# EAGLE schematic Aegis PCB 3D - 2 v37 (EAGLE 9.7.0)

## Sheet 1 of 4: Board Conn
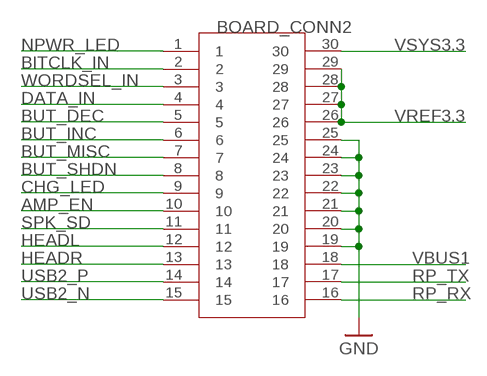
[diagram p0: schematic, sheet 1]

### Parts
BOARD_CONN2  CONN-AXK6F30347YG  [CONN-AXK6F30347YG]

### Nets
AMP_EN: BOARD_CONN2.10 ; also sheet 3
BITCLK_IN: BOARD_CONN2.2 ; also sheet 3
BUT_DEC: BOARD_CONN2.5 ; also sheet 4
BUT_INC: BOARD_CONN2.6 ; also sheet 4
BUT_MISC: BOARD_CONN2.7 ; also sheet 4
BUT_SHDN: BOARD_CONN2.8 ; also sheet 4
CHG_LED: BOARD_CONN2.9 ; also sheet 4
DATA_IN: BOARD_CONN2.4 ; also sheet 3
GND: BOARD_CONN2.19 BOARD_CONN2.20 BOARD_CONN2.21 BOARD_CONN2.22 BOARD_CONN2.23 BOARD_CONN2.24 BOARD_CONN2.25 ; also sheet 2,3,4
HEADL: BOARD_CONN2.12 ; also sheet 3
HEADR: BOARD_CONN2.13 ; also sheet 3
NPWR_LED: BOARD_CONN2.1 ; also sheet 2
RP_RX: BOARD_CONN2.16 ; also sheet 2
RP_TX: BOARD_CONN2.17 ; also sheet 2
SPK_SD: BOARD_CONN2.11 ; also sheet 3
USB2_N: BOARD_CONN2.15 ; also sheet 2
USB2_P: BOARD_CONN2.14 ; also sheet 2
VBUS1: BOARD_CONN2.18 ; also sheet 2
VREF3.3: BOARD_CONN2.26 BOARD_CONN2.27 BOARD_CONN2.28 BOARD_CONN2.29 ; also sheet 2,3
VSYS3.3: BOARD_CONN2.30 ; also sheet 4
WORDSEL_IN: BOARD_CONN2.3 ; also sheet 3

## Sheet 2 of 4: Controller
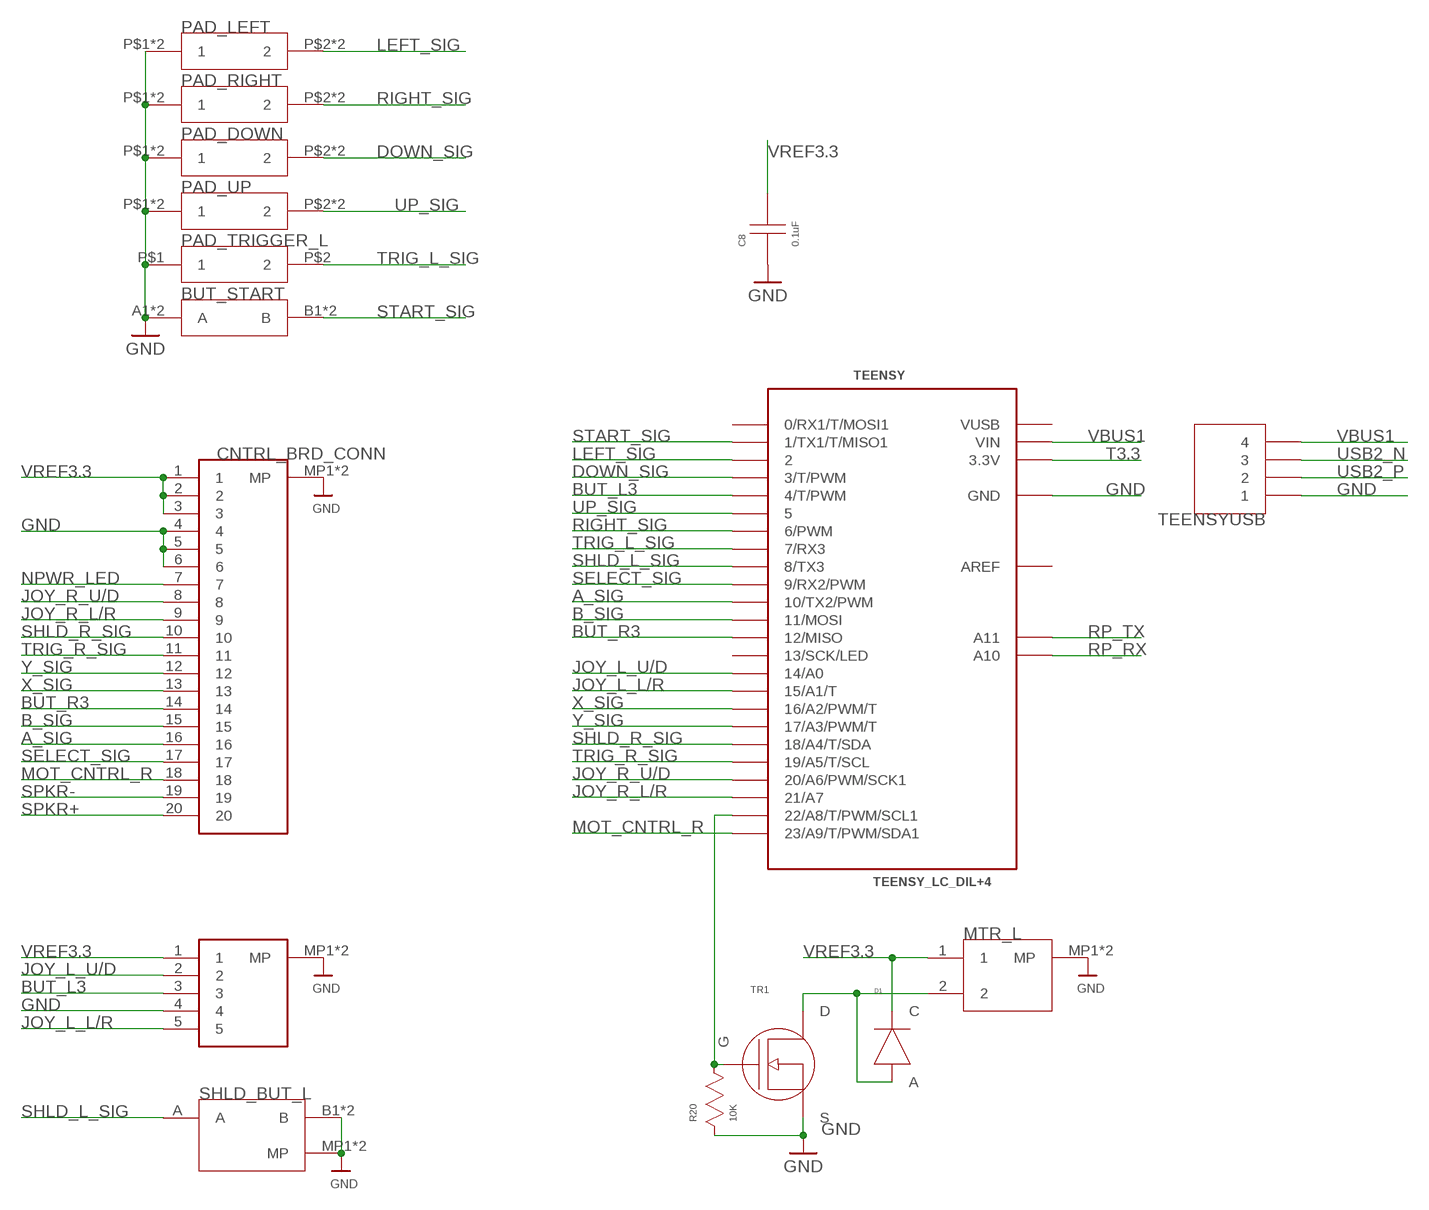
[diagram p1: schematic, sheet 2]

### Parts
BUT_START  BUT-R-667834  [BUT-R-667834]
C8  0.1uF  CAP-603  [CAP-603]
CNTRL_BRD_CONN  CONN-0527462033  [CONN-0527462033]
D1  DIODE-X3-WLB1608-2  [DIODE-X3-WLB1608-2]
JOYSTICK_L  CONN-046809605110846+  [CONN-046809605110846+]
MTR_L  CONN-0781710002  [CONN-0781710002]
PAD_DOWN  AEGIS-BUTTONPAD  [AEGIS-BUTTONPAD]
PAD_LEFT  AEGIS-BUTTONPAD  [AEGIS-BUTTONPAD]
PAD_RIGHT  AEGIS-BUTTONPAD  [AEGIS-BUTTONPAD]
PAD_TRIGGER_L  AEGIN-SHLDPAD  [AEGIN-SHLDPAD]
PAD_UP  AEGIS-BUTTONPAD  [AEGIS-BUTTONPAD]
R20  10K  RES-603  [RES-603]
SHLD_BUT_L  AEGIN-SHLDBUT  [AEGIN-SHLDBUT]
TEENSY  TEENSY_LC_DIL+4  [TEENSY_3.0-3.2&LC_DIL+4]
TEENSYUSB  CONN_4PIN  [CONN_4PIN]
TR1  TRAN-DMG2302UKQ  [TRAN-DMG2302UKQ]

### Nets
A_SIG: CNTRL_BRD_CONN.16 TEENSY.10(10/TX2/PWM)
B_SIG: CNTRL_BRD_CONN.15 TEENSY.11(11/MOSI)
BUT_L3: JOYSTICK_L.3 TEENSY.4(4/T/PWM)
BUT_R3: CNTRL_BRD_CONN.14 TEENSY.12(12/MISO)
DOWN_SIG: PAD_DOWN.P$2 PAD_DOWN.P$4 TEENSY.3(3/T/PWM)
GND: BUT_START.A1(A) BUT_START.A2(A) C8.A CNTRL_BRD_CONN.4 CNTRL_BRD_CONN.5 CNTRL_BRD_CONN.6 CNTRL_BRD_CONN.MP1(MP) CNTRL_BRD_CONN.MP2(MP) JOYSTICK_L.4 JOYSTICK_L.MP1(MP) JOYSTICK_L.MP2(MP) MTR_L.MP1(MP) MTR_L.MP2(MP) PAD_DOWN.P$1 PAD_DOWN.P$3 PAD_LEFT.P$1 PAD_LEFT.P$3 PAD_RIGHT.P$1 PAD_RIGHT.P$3 PAD_TRIGGER_L.P$1 PAD_UP.P$1 PAD_UP.P$3 R20.A SHLD_BUT_L.B1(B) SHLD_BUT_L.B2(B) SHLD_BUT_L.MP1(MP) SHLD_BUT_L.MP2(MP) TEENSY.AGND(GND) TEENSY.GND TEENSYUSB.1 TR1.S ; also sheet 1,3,4
JOY_L_L/R: JOYSTICK_L.5 TEENSY.15/A1(15/A1/T)
JOY_L_U/D: JOYSTICK_L.2 TEENSY.14/A0
JOY_R_L/R: CNTRL_BRD_CONN.9 TEENSY.21/A7
JOY_R_U/D: CNTRL_BRD_CONN.8 TEENSY.20/A6(20/A6/PWM/SCK1)
LEFT_SIG: PAD_LEFT.P$2 PAD_LEFT.P$4 TEENSY.2
MOT_CNTRL_R: CNTRL_BRD_CONN.18 TEENSY.23/A9(23/A9/T/PWM/SDA1)
N$1: R20.C TEENSY.22/A8(22/A8/T/PWM/SCL1) TR1.G
N$8: D1.A MTR_L.2 TR1.D
NPWR_LED: CNTRL_BRD_CONN.7 ; also sheet 1
RIGHT_SIG: PAD_RIGHT.P$2 PAD_RIGHT.P$4 TEENSY.6(6/PWM)
RP_RX: TEENSY.A10 ; also sheet 1
RP_TX: TEENSY.A11 ; also sheet 1
SELECT_SIG: CNTRL_BRD_CONN.17 TEENSY.9(9/RX2/PWM)
SHLD_L_SIG: SHLD_BUT_L.A TEENSY.8(8/TX3)
SHLD_R_SIG: CNTRL_BRD_CONN.10 TEENSY.18/A4(18/A4/T/SDA)
SPKR+: CNTRL_BRD_CONN.20 ; also sheet 3
SPKR-: CNTRL_BRD_CONN.19 ; also sheet 3
START_SIG: BUT_START.B1(B) BUT_START.B2(B) TEENSY.1(1/TX1/T/MISO1)
T3.3: TEENSY.3.3V
TRIG_L_SIG: PAD_TRIGGER_L.P$2 TEENSY.7(7/RX3)
TRIG_R_SIG: CNTRL_BRD_CONN.11 TEENSY.19/A5(19/A5/T/SCL)
UP_SIG: PAD_UP.P$2 PAD_UP.P$4 TEENSY.5
USB2_N: TEENSYUSB.3 ; also sheet 1
USB2_P: TEENSYUSB.2 ; also sheet 1
VBUS1: TEENSY.VIN TEENSYUSB.4 ; also sheet 1
VREF3.3: C8.C CNTRL_BRD_CONN.1 CNTRL_BRD_CONN.2 CNTRL_BRD_CONN.3 D1.C JOYSTICK_L.1 MTR_L.1 ; also sheet 1,3
X_SIG: CNTRL_BRD_CONN.13 TEENSY.16/A2(16/A2/PWM/T)
Y_SIG: CNTRL_BRD_CONN.12 TEENSY.17/A3(17/A3/PWM/T)
Unconnected: TEENSY.0(0/RX1/T/MOSI1) TEENSY.13(13/SCK/LED)

## Sheet 3 of 4: Audio
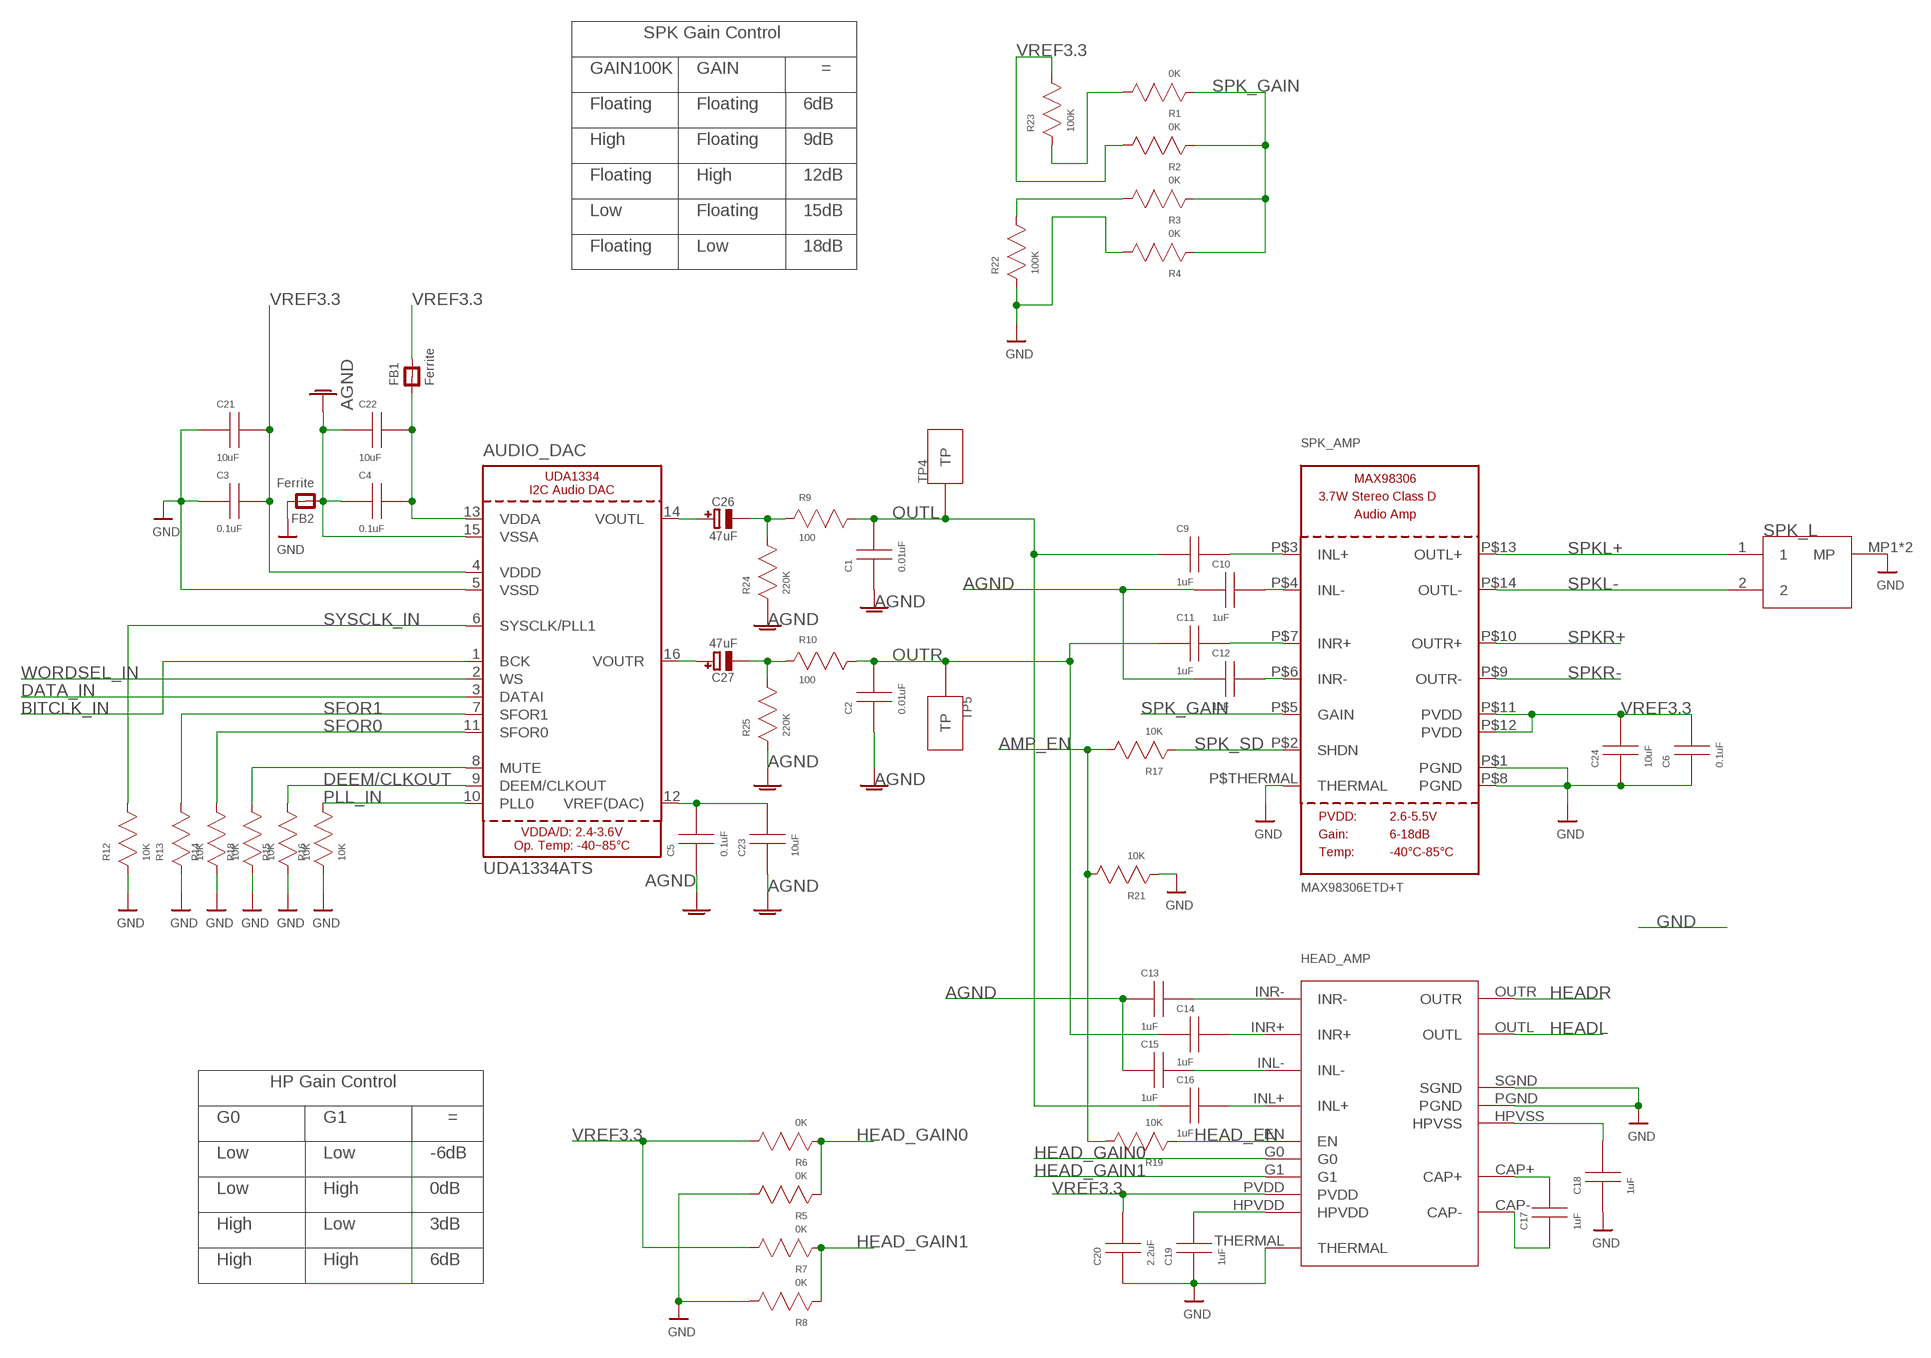
[diagram p2: schematic, sheet 3]

### Parts
AUDIO_DAC  UDA1334ATS  AUDIO_I2S_UDA1334""  [SSOP16_4.4MM]
C1  0.01uF  CAP-603  [CAP-603]
C2  0.01uF  CAP-603  [CAP-603]
C3  0.1uF  CAP-603  [CAP-603]
C4  0.1uF  CAP-603  [CAP-603]
C5  0.1uF  CAP-603  [CAP-603]
C6  0.1uF  CAP-603  [CAP-603]
C9  1uF  CAP-603  [CAP-603]
C10  1uF  CAP-603  [CAP-603]
C11  1uF  CAP-603  [CAP-603]
C12  1uF  CAP-603  [CAP-603]
C13  1uF  CAP-603  [CAP-603]
C14  1uF  CAP-603  [CAP-603]
C15  1uF  CAP-603  [CAP-603]
C16  1uF  CAP-603  [CAP-603]
C17  1uF  CAP-603  [CAP-603]
C18  1uF  CAP-603  [CAP-603]
C19  1uF  CAP-603  [CAP-603]
C20  2.2uF  CAP-603  [CAP-603]
C21  10uF  CAP-603  [CAP-603]
C22  10uF  CAP-603  [CAP-603]
C23  10uF  CAP-603  [CAP-603]
C24  10uF  CAP-603  [CAP-603]
C26  47uF  CAP_ELECTROLYTICPANASONIC_C  [PANASONIC_C]
C27  47uF  CAP_ELECTROLYTICPANASONIC_C  [PANASONIC_C]
FB1  Ferrite  FERRITE0805  [0805@1]
FB2  Ferrite  FERRITE0805  [0805@1]
HEAD_AMP  IC-PAM8908  [IC-PAM8908]
R1  0K  RES-603  [RES-603]
R2  0K  RES-603  [RES-603]
R3  0K  RES-603  [RES-603]
R4  0K  RES-603  [RES-603]
R5  0K  RES-603  [RES-603]
R6  0K  RES-603  [RES-603]
R7  0K  RES-603  [RES-603]
R8  0K  RES-603  [RES-603]
R9  100  RES-603  [RES-603]
R10  100  RES-603  [RES-603]
R12  10K  RES-603  [RES-603]
R13  10K  RES-603  [RES-603]
R14  10K  RES-603  [RES-603]
R15  10K  RES-603  [RES-603]
R16  10K  RES-603  [RES-603]
R17  10K  RES-603  [RES-603]
R18  10K  RES-603  [RES-603]
R19  10K  RES-603  [RES-603]
R21  10K  RES-603  [RES-603]
R22  100K  RES-603  [RES-603]
R23  100K  RES-603  [RES-603]
R24  220K  RES-603  [RES-603]
R25  220K  RES-603  [RES-603]
SPK_AMP  MAX98306ETD+T  AUDIOAMP_MAX98306  [TDFN14_3X3MM]
SPK_L  CONN-0781710002  [CONN-0781710002]
TP4  TESTPOINT  [TESTPOINT]
TP5  TESTPOINT  [TESTPOINT]

### Nets
AGND: AUDIO_DAC.15(VSSA) C1.A C2.A C4.A C5.A C10.A C12.A C13.A C15.A C22.A C23.A FB2.1 R24.A R25.A
AMP_EN: R17.C R19.C R21.C ; also sheet 1
BITCLK_IN: AUDIO_DAC.1(BCK) ; also sheet 1
DATA_IN: AUDIO_DAC.3(DATAI) ; also sheet 1
DEEM/CLKOUT: AUDIO_DAC.9(DEEM/CLKOUT) R15.C
GND: AUDIO_DAC.5(VSSD) C3.A C6.A C18.A C19.A C20.A C21.A C24.A FB2.2 HEAD_AMP.PGND HEAD_AMP.SGND HEAD_AMP.THERMAL R4.C R5.C R8.C R12.A R13.A R14.A R15.A R16.A R18.A R21.A R22.A SPK_AMP.P$1(PGND) SPK_AMP.P$8(PGND) SPK_AMP.P$THERMAL(THERMAL) SPK_L.MP1(MP) SPK_L.MP2(MP) ; also sheet 1,2,4
HEAD_EN: HEAD_AMP.EN R19.A
HEAD_GAIN0: HEAD_AMP.G0 R5.A R6.A
HEAD_GAIN1: HEAD_AMP.G1 R7.A R8.A
HEADL: HEAD_AMP.OUTL ; also sheet 1
HEADR: HEAD_AMP.OUTR ; also sheet 1
N$2: AUDIO_DAC.8(MUTE) R18.C
N$3: AUDIO_DAC.13(VDDA) C4.C C22.C FB1.1
N$5: C27.- R10.A R25.C
N$7: C26.- R9.A R24.C
N$9: C13.C HEAD_AMP.INR-
N$10: AUDIO_DAC.12(VREF(DAC)) C5.C C23.C
N$12: AUDIO_DAC.16(VOUTR) C27.+
N$13: AUDIO_DAC.14(VOUTL) C26.+
N$14: R1.C R23.A
N$15: R3.C R22.C
N$16: C9.C SPK_AMP.P$3(INL+)
N$17: C10.C SPK_AMP.P$4(INL-)
N$18: C11.C SPK_AMP.P$7(INR+)
N$19: C12.C SPK_AMP.P$6(INR-)
N$21: C14.C HEAD_AMP.INR+
N$22: C16.C HEAD_AMP.INL+
N$23: C15.C HEAD_AMP.INL-
N$24: C17.C HEAD_AMP.CAP+
N$28: C17.A HEAD_AMP.CAP-
N$29: C18.C HEAD_AMP.HPVSS
N$30: C19.C HEAD_AMP.HPVDD
OUTL: C1.C C9.A C16.A R9.C TP4.TP
OUTR: C2.C C11.A C14.A R10.C TP5.TP
PLL_IN: AUDIO_DAC.10(PLL0) R16.C
SFOR0: AUDIO_DAC.11(SFOR0) R14.C
SFOR1: AUDIO_DAC.7(SFOR1) R13.C
SPK_GAIN: R1.A R2.A R3.A R4.A SPK_AMP.P$5(GAIN)
SPK_SD: R17.A SPK_AMP.P$2(SHDN) ; also sheet 1
SPKL+: SPK_AMP.P$13(OUTL+) SPK_L.1
SPKL-: SPK_AMP.P$14(OUTL-) SPK_L.2
SPKR+: SPK_AMP.P$10(OUTR+) ; also sheet 2
SPKR-: SPK_AMP.P$9(OUTR-) ; also sheet 2
SYSCLK_IN: AUDIO_DAC.6(SYSCLK/PLL1) R12.C
VREF3.3: AUDIO_DAC.4(VDDD) C3.C C6.C C20.C C21.C C24.C FB1.2 HEAD_AMP.PVDD R2.C R6.C R7.C R23.C SPK_AMP.P$11(PVDD) SPK_AMP.P$12(PVDD) ; also sheet 1,2
WORDSEL_IN: AUDIO_DAC.2(WS) ; also sheet 1

### Notes on the sheet
- SPK Gain Control
- GAIN100K | GAIN | =
- Floating | Floating | 6dB
- High | Floating | 9dB
- Floating | High | 12dB
- Low | Floating | 15dB
- Floating | Low | 18dB
- HP Gain Control
- G0 | G1 | =
- Low | Low | -6dB
- Low | High | 0dB
- High | Low | 3dB
- High | High | 6dB

## Sheet 4 of 4: Button/LED
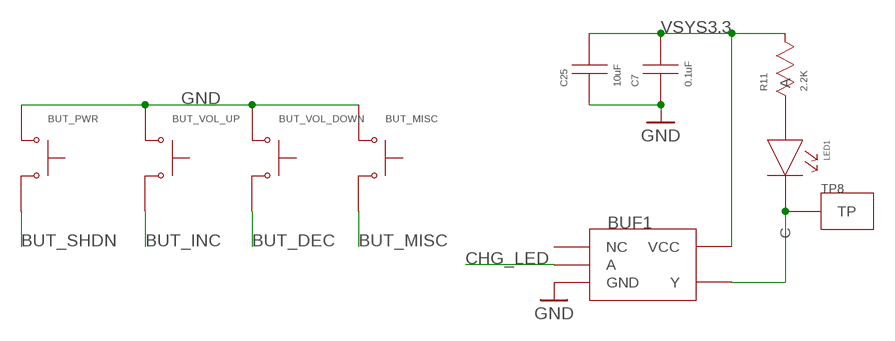
[diagram p3: schematic, sheet 4]

### Parts
BUF1  BUF-74LVC1G07  [BUF-74LVC1G07]
BUT_MISC  BUT-KSS331GLFS  [BUT-KSS331GLFS]
BUT_PWR  BUT-KSS331GLFS  [BUT-KSS331GLFS]
BUT_VOL_DOWN  BUT-KSS331GLFS  [BUT-KSS331GLFS]
BUT_VOL_UP  BUT-KSS331GLFS  [BUT-KSS331GLFS]
C7  0.1uF  CAP-603  [CAP-603]
C25  10uF  CAP-603  [CAP-603]
LED1  LED-SM0805UWC  [LED-SM0805UWC]
R11  2.2K  RES-603  [RES-603]
TP8  TESTPOINT  [TESTPOINT]

### Nets
BUT_DEC: BUT_VOL_DOWN.2 ; also sheet 1
BUT_INC: BUT_VOL_UP.2 ; also sheet 1
BUT_MISC: BUT_MISC.2 ; also sheet 1
BUT_SHDN: BUT_PWR.2 ; also sheet 1
CHG_LED: BUF1.A ; also sheet 1
GND: BUF1.GND BUT_MISC.1 BUT_PWR.1 BUT_VOL_DOWN.1 BUT_VOL_UP.1 C7.A C25.A ; also sheet 1,2,3
N$50: LED1.A R11.A
N$51: BUF1.Y LED1.C TP8.TP
VSYS3.3: BUF1.VCC C7.C C25.C R11.C ; also sheet 1
Unconnected: BUF1.NC

## Power pins joined to a net without a drawn wire
AREF: TEENSY.AREF
VUSB: TEENSY.VUSB

## Library data of the parts
AUDIO_DAC = microbuilder:AUDIO_I2S_UDA1334: UDA1334 I2C Audio DAC Power Supply: 2.4-3.6V Sample frequencies from 16-100kHz
BOARD_CONN2 = Personal:CONN-AXK6F30347YG
BUF1 = Personal:BUF-74LVC1G07
BUT_MISC BUT_PWR BUT_VOL_DOWN BUT_VOL_UP = Personal:BUT-KSS331GLFS
BUT_START = Personal:BUT-R-667834
C1-C25 = Personal:CAP-603
C26 C27 = microbuilder:CAP_ELECTROLYTIC: Electrolytic Capacitors SMT PANASONIC_C - Size C Panasonic Electrolytic Aluminum Capacitor 47µF 16V 20% Electrolytic Capacitor [Digikey: PCE3890TR-ND] PANASONIC_D - Size D Panasonic Electrolytic Aluminum Capacitor 100µF 25V 20% Electrolytic Capacitor [Digikey: PCE3898TR-ND] PTH 3.5 mm grid, 8 mm diameter ... 3.5 mm grid, 10 mm diameter ...
CNTRL_BRD_CONN = Personal:CONN-0527462033
D1 = Personal:DIODE-X3-WLB1608-2
FB1 FB2 = microbuilder:FERRITE: Ferrite Bead 0603 MMZ1608B121C - 120 Ohm @ 100MHz, 600mA, 0.15 Ohm DC Resistance - Digikey: 445-2164-1-ND BK1608HW121-T - 120 Ohm, 600mA Ferrite Chip - Digikey: 587-1876-2-ND 0805 HZ0805B272R-10 - 2.7K Ohm @ 100MHz, 200mA, 0.8 Ohm DC Resistance - Digikey: 240-2504-1-ND (see also Murata BLM21BD272SN1L) MMZ2012Y152B - 1.5K Ohm @ 100MHz, 500mA, 0.4 Ohm DC Resistance - Digikey: 445-1560-1-ND - Mainly for high frequency (80-400MHz) MMZ2012R102A - 1K Ohm @ 100MHz, 500mA, 0.3 Ohm DC Resistance - Digikey: 445-1555-2-ND - More general purpose (10-200MHz)
HEAD_AMP = Personal:IC-PAM8908
JOYSTICK_L = Personal:CONN-046809605110846+
LED1 = Personal:LED-SM0805UWC
MTR_L SPK_L = Personal:CONN-0781710002
PAD_DOWN PAD_LEFT PAD_RIGHT PAD_UP = Personal:AEGIS-BUTTONPAD
PAD_TRIGGER_L = Personal:AEGIN-SHLDPAD
R1-R25 = Personal:RES-603
SHLD_BUT_L = Personal:AEGIN-SHLDBUT
SPK_AMP = microbuilder:AUDIOAMP_MAX98306: MAX98306 3.7W Stereo Audio Amp - TDFN14 3.7W @ 3 ohm, 2.6-5.5V supply, 6-18dB selectable gain
TEENSY = Teensy_3_and_LC_Series_Boards_v1.4:TEENSY_LC_DIL+4: DIL package with 4 pins on the inside broken out.
TEENSYUSB = Personal:CONN_4PIN
TP4 TP5 TP8 = Personal:TESTPOINT
TR1 = Personal:TRAN-DMG2302UKQ

## Net classes
1 PWR 1A: width 0.254 mm